# EAGLE design ATS (EAGLE 9.6.1)
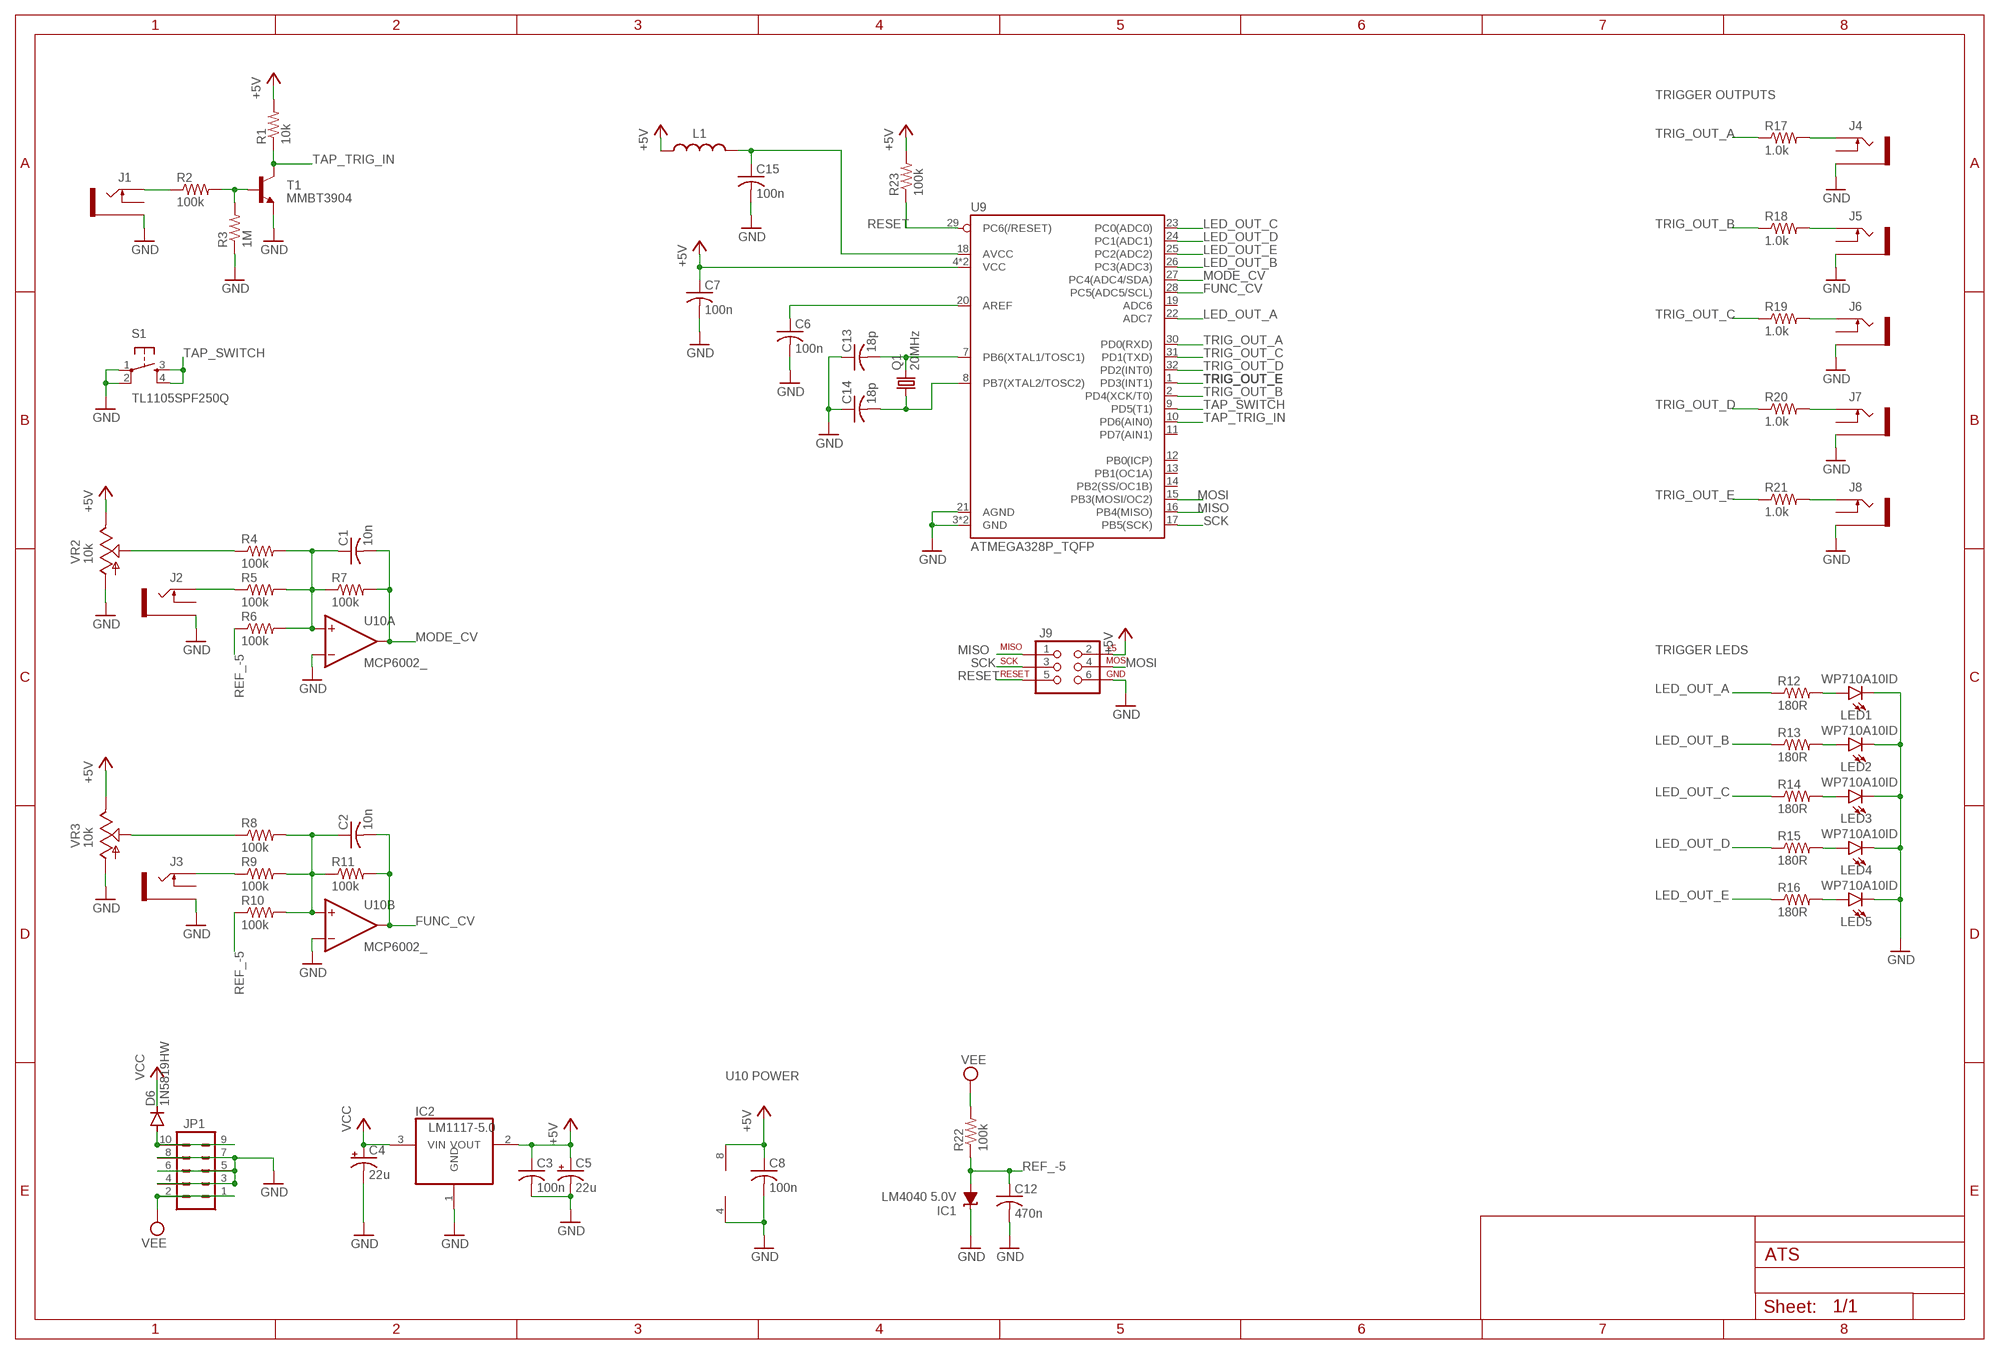
[diagram p0: schematic, sheet 1]

## Parts
C1  10n  C-USC0603  [C0603]
C2  10n  C-USC0603  [C0603]
C3  100n  C-USC0603  [C0603]
C4  22u  CPOL-USC  [PANASONIC_C]
C5  22u  CPOL-USC  [PANASONIC_C]
C6  100n  C-USC0603  [C0603]
C7  100n  C-USC0603  [C0603]
C8  100n  C-USC0603  [C0603]
C12  470n  C-USC0603  [C0603]
C13  18p  C-USC0603  [C0603]
C14  18p  C-USC0603  [C0603]
C15  100n  C-USC0603  [C0603]
D6  1N5819HW  DIODE-SOD123  [SOD123]
IC1  LM4040 5.0V  LM4041C12DBZ  [DBZ_R-PDSO-G3]
IC2  LM1117-5.0  REG1117  [SOT223]
J1  THONKICONNNEW  [WQP-PJ301M-12_JACK]
J2  THONKICONNNEW  [WQP-PJ301M-12_JACK]
J3  THONKICONNNEW  [WQP-PJ301M-12_JACK]
J4  THONKICONNNEW  [WQP-PJ301M-12_JACK]
J5  THONKICONNNEW  [WQP-PJ301M-12_JACK]
J6  THONKICONNNEW  [WQP-PJ301M-12_JACK]
J7  THONKICONNNEW  [WQP-PJ301M-12_JACK]
J8  THONKICONNNEW  [WQP-PJ301M-12_JACK]
J9  AVR_SPI_PRG_6PTH  [2X3]
JP1  EURO_POWER_HEADERREGULAR  [EURO_POWER_HEADER]
L1  470Ohm@100MHz  WE-CBF_0603_742792642_WB_HS  [WE-CBF_0603(W=2.2)]
LED1  WP710A10ID  LED3MM  [LED_3MM]
LED2  WP710A10ID  LED3MM  [LED_3MM]
LED3  WP710A10ID  LED3MM  [LED_3MM]
LED4  WP710A10ID  LED3MM  [LED_3MM]
LED5  WP710A10ID  LED3MM  [LED_3MM]
Q1  20MHz  CRYSTALHC49UP  [HC49UP]
R1  10k  R-US_R0603  [R0603]
R2  100k  R-US_R0603  [R0603]
R3  1M  R-US_R0603  [R0603]
R4  100k  R-US_R0603  [R0603]
R5  100k  R-US_R0603  [R0603]
R6  100k  R-US_R0603  [R0603]
R7  100k  R-US_R0603  [R0603]
R8  100k  R-US_R0603  [R0603]
R9  100k  R-US_R0603  [R0603]
R10  100k  R-US_R0603  [R0603]
R11  100k  R-US_R0603  [R0603]
R12  180R  R-US_R0603  [R0603]
R13  180R  R-US_R0603  [R0603]
R14  180R  R-US_R0603  [R0603]
R15  180R  R-US_R0603  [R0603]
R16  180R  R-US_R0603  [R0603]
R17  1.0k  R-US_R0603  [R0603]
R18  1.0k  R-US_R0603  [R0603]
R19  1.0k  R-US_R0603  [R0603]
R20  1.0k  R-US_R0603  [R0603]
R21  1.0k  R-US_R0603  [R0603]
R22  100k  R-US_R0603  [R0603]
R23  100k  R-US_R0603  [R0603]
S1  TL1105SPF250Q  TAC_SWITCHPTH  [TACTILE-PTH]
T1  MMBT3904  MMBT3904LT1-NPN-SOT23-BEC  [SOT23-BEC]
U9  ATMEGA328P_TQFP  [TQFP32-08]
U10  MCP6002_  [SO08]
VR2  10k  9MM_SNAP-IN_POT_  [9MM_SNAP-IN_POT]
VR3  10k  9MM_SNAP-IN_POT_  [9MM_SNAP-IN_POT]

## Nets
+5V: C3.1 C5.+ C7.1 C8.1 IC2.2(VOUT) J9.2 L1.1 R1.2 R23.2 U9.4(VCC) U9.6(VCC) U10.8(P:V+) VR2.3(E) VR3.3(E)
AREF: C6.1 U9.20(AREF)
FUNC_CV: C2.2 R11.2 U9.28(PC5(ADC5/SCL)) U10.7(B:OUT)
FUNC_JACK: J3.P$1_TIP(TIP) R9.1
FUNC_POT: R8.1 VR3.2(S)
GND: C3.2 C4.- C5.- C6.2 C7.2 C8.2 C12.2 C13.1 C14.1 C15.2 IC1.1(C) IC2.1(GND) J1.P$3_SLEEVE(SLEEVE) J2.P$3_SLEEVE(SLEEVE) J3.P$3_SLEEVE(SLEEVE) J4.P$3_SLEEVE(SLEEVE) J5.P$3_SLEEVE(SLEEVE) J6.P$3_SLEEVE(SLEEVE) J7.P$3_SLEEVE(SLEEVE) J8.P$3_SLEEVE(SLEEVE) J9.6 JP1.3 JP1.4 JP1.5 JP1.6 JP1.7 JP1.8 LED1.K(C) LED2.K(C) LED3.K(C) LED4.K(C) LED5.K(C) R3.1 S1.1 S1.2 T1.E U9.3(GND) U9.5(GND) U9.21(AGND) U10.2(A:-IN) U10.4(P:V-) U10.6(B:-IN) VR2.1(A) VR3.1(A)
LED_OUT_A: R12.1 U9.22(ADC7)
LED_OUT_B: R13.1 U9.26(PC3(ADC3))
LED_OUT_C: R14.1 U9.23(PC0(ADC0))
LED_OUT_D: R15.1 U9.24(PC1(ADC1))
LED_OUT_E: R16.1 U9.25(PC2(ADC2))
MISO: J9.1 U9.16(PB4(MISO))
MODE_CV: C1.2 R7.2 U9.27(PC4(ADC4/SDA)) U10.1(A:OUT)
MODE_JACK: J2.P$1_TIP(TIP) R5.1
MODE_POT: R4.1 VR2.2(S)
MOSI: J9.4 U9.15(PB3(MOSI/OC2))
N$1: LED1.A R12.2
N$2: C1.1 R4.2 R5.2 R6.2 R7.1 U10.3(A:+IN)
N$6: C2.1 R8.2 R9.2 R10.2 R11.1 U10.5(B:+IN)
N$8: LED2.A R13.2
N$9: LED3.A R14.2
N$10: R2.2 R3.2 T1.B
N$11: J1.P$1_TIP(TIP) R2.1
N$12: LED4.A R15.2
N$13: LED5.A R16.2
N$14: J4.P$1_TIP(TIP) R17.2
N$15: J5.P$1_TIP(TIP) R18.2
N$16: J6.P$1_TIP(TIP) R19.2
N$17: J7.P$1_TIP(TIP) R20.2
N$18: J8.P$1_TIP(TIP) R21.2
N$23: C14.2 Q1.1 U9.8(PB7(XTAL2/TOSC2))
N$24: C13.2 Q1.2 U9.7(PB6(XTAL1/TOSC1))
N$25: C15.1 L1.2 U9.18(AVCC)
N$27: D6.A JP1.9 JP1.10
REF_-5: C12.1 IC1.2(A) R6.1 R10.1 R22.1
RESET: J9.5 R23.1 U9.29(PC6(/RESET))
SCK: J9.3 U9.17(PB5(SCK))
TAP_SWITCH: S1.3 S1.4 U9.9(PD5(T1))
TAP_TRIG_IN: R1.1 T1.C U9.10(PD6(AIN0))
TRIG_OUT_A: R17.1 U9.30(PD0(RXD))
TRIG_OUT_B: R18.1 U9.2(PD4(XCK/T0))
TRIG_OUT_C: R19.1 U9.31(PD1(TXD))
TRIG_OUT_D: R20.1 U9.32(PD2(INT0))
TRIG_OUT_E: R21.1 U9.1(PD3(INT1))
VCC: C4.+ D6.C IC2.3(VIN)
VEE: JP1.1 JP1.2 R22.2
Unconnected: J1.P$2_SWITCH(SWITCH) J2.P$2_SWITCH(SWITCH) J3.P$2_SWITCH(SWITCH) J4.P$2_SWITCH(SWITCH) J5.P$2_SWITCH(SWITCH) J6.P$2_SWITCH(SWITCH) J7.P$2_SWITCH(SWITCH) J8.P$2_SWITCH(SWITCH) U9.11(PD7(AIN1)) U9.12(PB0(ICP)) U9.13(PB1(OC1A)) U9.14(PB2(SS/OC1B)) U9.19(ADC6)

## Notes on the sheet
- TRIGGER OUTPUTS
- TRIGGER LEDS
- U10 POWER

## Library data of the parts
C1-C3 C6-C8 C12-C15 = rcl:C-US: CAPACITOR, American symbol; SPICEPREFIX: C
C4 C5 = rcl:CPOL-US: POLARIZED CAPACITOR, American symbol; SPICEPREFIX: C
D6 = diode:DIODE-: DIODE
IC1 = texas:LM4041: PRECISION MICROPOWER SHUNT VOLTAGE REFERENCE Source: http://focus.ti.com/lit/ds/slcs146e/slcs146e.pdf; MF: TEXAS INSTRUMENT CONNECTORS; MPN: LM4041C12QDBZT; OC_FARNELL: 1771733; OC_NEWARK: 43K3376
IC2 = burr-brown:REG1117: 800mA and 1A Low Dropout (LDO) Positive Regulator 1.8V, 2.5V, 2.85V, 3.3V, 5V, and Adj; MPN: REG1117; OC_FARNELL: 1097566; OC_NEWARK: 14P6981
J1-J8 = MusicThingModular:THONKICONN: 3.5mm socket for Eurorack modular synths
J9 = SparkFun:AVR_SPI_PRG_6: AVR ISP 6 Pin This is the reduced ISP connector for AVR programming. Common on Arduino. This footprint will take up less PCB space and can be used with a 10-pin to 6-pin adapter such as SKU: BOB-08508
JP1 = MusicThingModular:EURO_POWER_HEADER: Power Header 10 pin power header for Eurorack Power Supplies Variants with fatter pads for easier soldering, and the LOCK variant which has 5mil offset pins to hold the component in place before soldering
L1 = Eagle_WE-CBF_rev19b:WE-CBF_0603: WE-CBF SMD EMI Suppression Ferrite Bead Characteristics Reliable Ni-Sn electrodes High rated current up to 6 A Operating temperature: –55 ºC to +125 ºC Applications Perfect as data lined filter and for uncoupling of distribution voltage Package name and Variant abbreviation: Package: Wide Band /High Speed: W=Width= 2.2 High Current: W=Width= 2.6 Variant abbreviation: WB = Wide Band HS=High Speed HC=High Current <https://katalog.we-online.de/media/images/v2/o14753v209%20Family_WE-CBF.jpg> Details see: http://katalog.we-online.de/en/pbs/WE-CBF Updated by Ella Wu 2019-01-02 2019 (C) Wurth Elektronik; DATASHEET-URL: https://www.we-online.com/catalog/datasheet/742792642.pdf; IR1: 200mA; IR2: 950mA; MOUNT: SMT; PART-NUMBER: 742792642; RDC-MAX: 0.45Ohm; TYPE: Wide Band; Z: 256Ohm@1GMHz; ZMAX: 780Ohm
LED1 = SparkFun-LED:LED: LED (Generic) Standard schematic elements and footprints for 5mm, 3mm, 1206, and 0603 sized LEDs. Generic LEDs with no color specified.; PROD_ID: DIO-08794; SPICEPREFIX: D
LED2-LED5 = SparkFun-LED:LED: LED (Generic) Standard schematic elements and footprints for 5mm, 3mm, 1206, and 0603 sized LEDs. Generic LEDs with no color specified.; PROD_ID: DIO-08794
Q1 = crystal:CRYSTAL: CRYSTAL; OC_FARNELL: unknown; OC_NEWARK: unknown
R1-R23 = rcl:R-US_: RESISTOR, American symbol; SPICEPREFIX: R
S1 = SparkFun-Retired:TAC_SWITCH: Momentary Switch Button commonly used for reset or general input. Spark Fun Electronics SKU : COM-00097 SMT- SWCH-08247
T1 = MusicThingModular:*-NPN-: NPN Transistror BF959 corrected 2008.03.06
U9 = SparkFun-IC-Microcontroller:ATMEGA328P_TQFP: Popular 328P in QFP Storefront component: ATmega328 - TQFP <https://www.sparkfun.com/products/13448> (COM-13448) Datasheet <http://www.sparkfun.com/datasheets/Components/SMD/ATMega328.pdf> SparkFun Products SparkFun RedBoard - Programmed with Arduino <https://www.sparkfun.com/products/12757> (DEV-12757) Arduino Pro Mini 328 - 5V/16MHz <https://www.sparkfun.com/products/11113> (DEV-11113) Arduino Pro Mini 328 - 3.3V/8MHz <https://www.sparkfun.com/products/11114> (DEV-11114) SparkFun OpenLog <https://www.sparkfun.com/products/13712> (DEV-13712) SparkFun MicroView - OLED Arduino Module <https://www.sparkfun.com/products/12923> (DEV-12923) SparkFun Digital Sandbox <https://www.sparkfun.com/products/12651> (DEV-12651) SparkFun PicoBoard <https://www.sparkfun.com/products/11888> (WIG-11888) Arduino Fio <https://www.sparkfun.com/products/10116> (DEV-10116) LilyPad Arduino 328 Main Board <https://www.sparkfun.com/products/13342> (DEV-13342) SparkFun RedStick <https://www.sparkfun.com/products/13741> (DEV-13741) LilyPad MP3 <https://www.sparkfun.com/products/11013> (DEV-11013) LilyPad Arduino SimpleSnap <https://www.sparkfun.com/products/10941> (DEV-10941) SparkFun Stepoko <https://www.sparkfun.com/products/13899> (ROB-13899) SparkFun Geiger Counter <https://www.sparkfun.com/products/11345> (SEN-11345) SparkFun EL Sequencer <https://www.sparkfun.com/products/12781> (COM-12781) Arduino Pro 328 - 5V/16MHz <https://www.sparkfun.com/products/10915> (DEV-10915) CryptoCape <https://www.sparkfun.com/products/12773> (DEV-12773) SparkFun IR Thermometer Evaluation Board - MLX90614 <https://www.sparkfun.com/products/10740> (SEN-10740) SparkFun RedBot Mainboard <https://www.sparkfun.com/products/12097> (ROB-12097) Arduino Pro 328 - 3.3V/8MHz <https://www.sparkfun.com/products/10914> (DEV-10914) SparkFun Block for Intel® Edison - Arduino <https://www.sparkfun.com/products/13036> (DEV-13036) SparkFun Simon Says - Surface Mount Soldering Kit <https://www.sparkfun.com/products/10935> (KIT-10935) SparkFun 7-Segment Serial Display - Red <https://www.sparkfun.com/products/11441> (COM-11441) SparkFun 7-Segment Serial Display - White <https://www.sparkfun.com/products/11629> (COM-11629) SparkFun 7-Segment Serial Display - Yellow <https://www.sparkfun.com/products/11443> (COM-11443) SparkFun 7-Segment Serial Display - Kelly Green <https://www.sparkfun.com/products/11440> (COM-11440) SparkFun 7-Segment Serial Display - Blue <https://www.sparkfun.com/products/11442> (COM-11442) SparkFun OpenSegment Serial Display - 20mm (Blue) <https://www.sparkfun.com/products/11647> (COM-11647) SparkFun OpenSegment Serial Display - 20mm (Green) <https://www.sparkfun.com/products/11646> (COM-11646) SparkFun OpenSegment Serial Display - 20mm (White) <https://www.sparkfun.com/products/11648> (COM-11648) SparkFun OpenSegment Serial Display - 20mm (Red) <https://www.sparkfun.com/products/11644> (COM-11644) SparkFun OpenSegment Serial Display - 20mm (Yellow) <https://www.sparkfun.com/products/11645> (COM-11645) SparkFun OpenSegment Shield <https://www.sparkfun.com/products/13190> (DEV-13190); PROD_ID: IC-09069
U10 = MusicThingModular:MCP6002: Generic Dual Op Amp
VR2 VR3 = MusicThingModular:9MM_SNAP-IN_POT: 9mm vertical snap-in pot, Alpha / Panasonic style

## Board
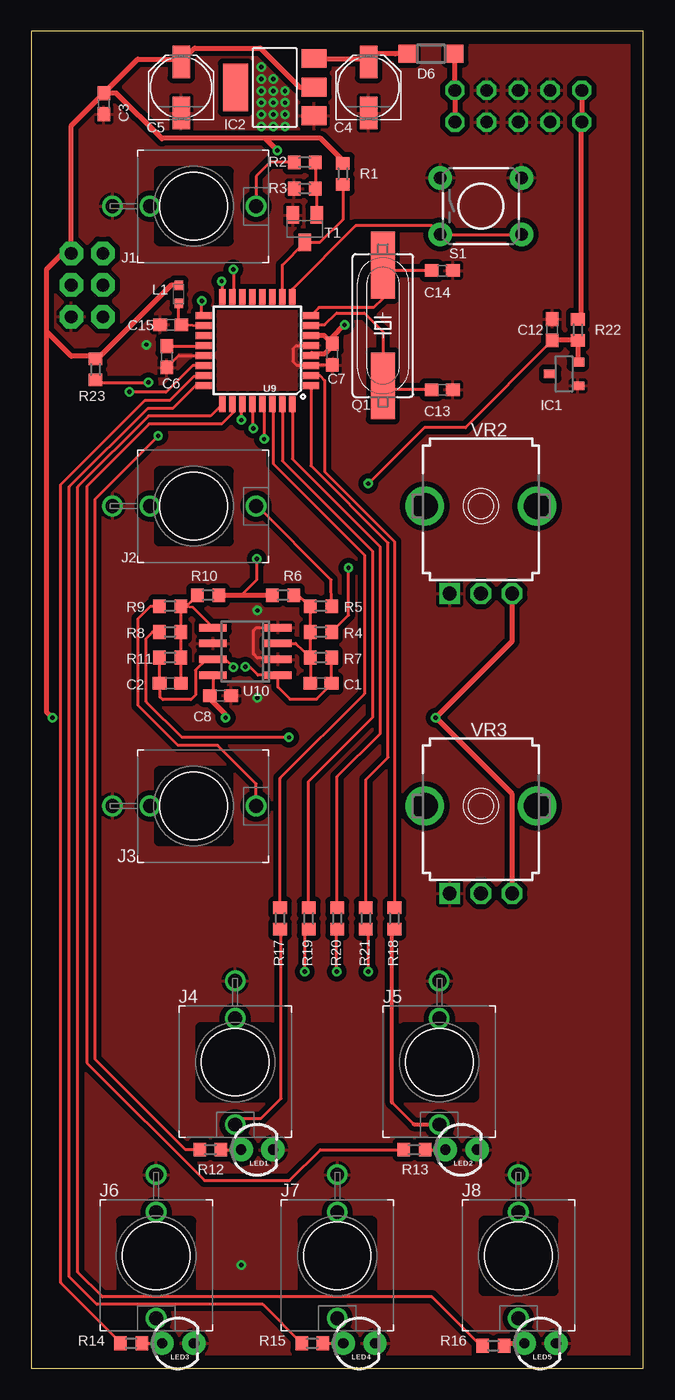
[diagram p1: board, top side]
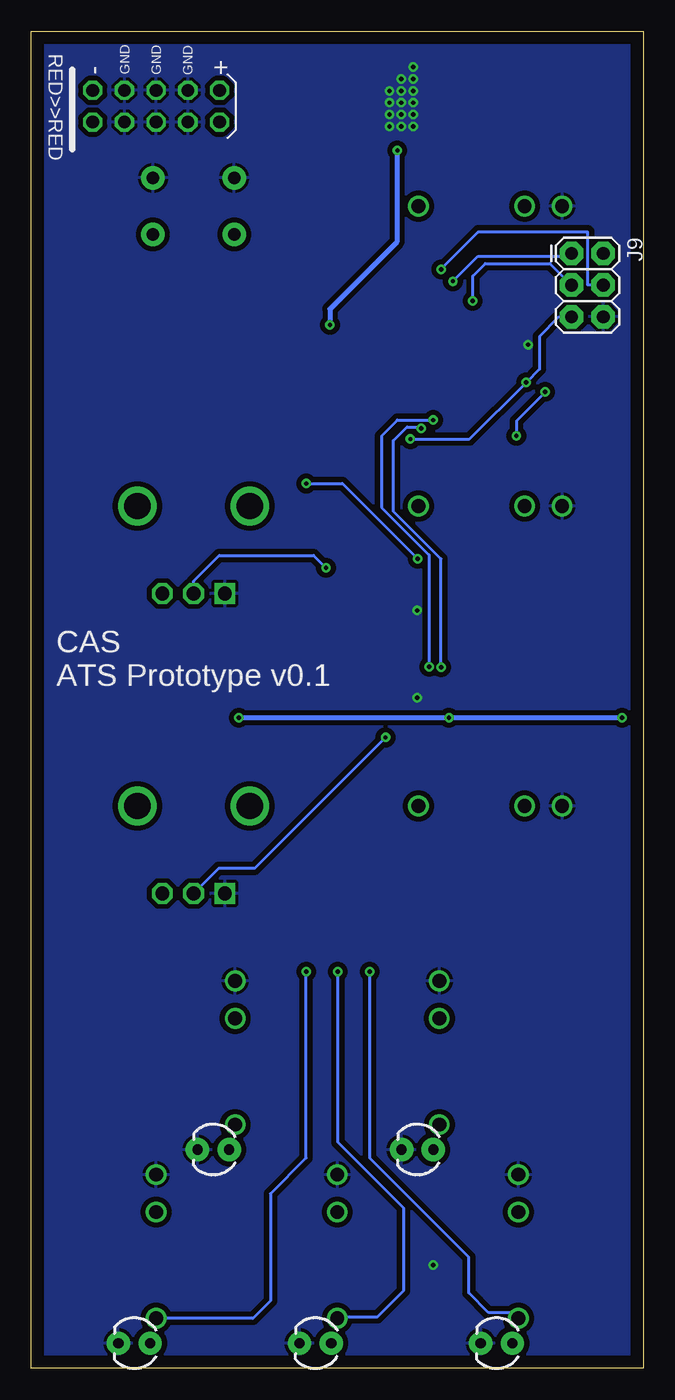
[diagram p2: board, bottom side, seen from below]

Size 49 x 107 mm. Coordinates in mm from the lower left corner, seen from the top.
Outline: 0,0 49,0 49,107 0,107 0,0
Copper layers (1*16): Top 0.035mm / dielectric 1.5mm / Bottom 0.035mm
Design rules "default": minimum track width 6mil, minimum drill 0.35mm, track to track 6mil, track to pad 6mil, pad to pad 6mil, via to via 6mil, smd to smd 6mil, copper to edge 40mil, drill to drill 6mil, minimum pad ring 10mil, minimum via ring 8mil, stop-mask expansion 4mil, vias tented up to drill 0mil, thermal gap 10mil

### Footprints (pad centres in the part's own frame; a part is rotated, then mirrored left to right if it is on the bottom)
C0603 = smd 1.1 x 1: 1 -0.85,0; 2 0.85,0
PANASONIC_C = smd 2.6 x 1.4: + 2.05,0; - -2.05,0
SOD123 = smd 1.4 x 1.4: A 1.9,0; C -1.9,0
DBZ_R-PDSO-G3 = smd 0.7 x 1: 1 -0.95,-1.1; 2 0.95,-1.1; 3 0,1.1
SOT223 = smd 1.499 x 2.007: 1 -2.261,-3.15; 2 0.025,-3.15; 3 2.311,-3.15 | smd 3.81 x 2.007: 4 0,3.15
WQP-PJ301M-12_JACK = drill 1.1: P$1_TIP 0,5; P$2_SWITCH 0,-3.5; P$3_SLEEVE 0,-6.5
2X3 = drill 1.016 pad 1.88 octagon: 1 0,0; 2 0,2.54; 3 2.54,0; 4 2.54,2.54; 5 5.08,0; 6 5.08,2.54
EURO_POWER_HEADER = drill 1.016 octagon: 1 -5.08,-1.27; 2 -5.08,1.27; 3 -2.54,-1.27; 4 -2.54,1.27; 5 0,-1.27; 6 0,1.27; 7 2.54,-1.27; 8 2.54,1.27; 9 5.08,-1.27; 10 5.08,1.27
WE-CBF_0603(W=2.2) = smd 0.75 x 0.7: 1 -0.725,0; 2 0.725,0
LED_3MM = drill 0.813 pad 1.88: A -1.27,0; K 1.27,0
HC49UP = smd 5.334 x 1.93: 1 -4.826,0; 2 4.826,0
R0603 = smd 1 x 1.1: 1 -0.85,0; 2 0.85,0
TACTILE-PTH = drill 1.016 pad 1.88: 1 -3.251,2.261; 2 3.251,2.261; 3 -3.251,-2.261; 4 3.251,-2.261
SOT23-BEC = smd 1 x 1.4: B -0.95,-1.1; C 0,1.1; E 0.95,-1.1
TQFP32-08 = smd 1.27 x 0.559: 1 -4.293,2.8; 2 -4.293,2; 3 -4.293,1.2; 4 -4.293,0.4; 5 -4.293,-0.4; 6 -4.293,-1.2; 7 -4.293,-2; 8 -4.293,-2.8; 17 4.293,-2.8; 18 4.293,-2; 19 4.293,-1.2; 20 4.293,-0.4; 21 4.293,0.4; 22 4.293,1.2; 23 4.293,2; 24 4.293,2.8 | smd 0.559 x 1.27: 9 -2.8,-4.293; 10 -2,-4.293; 11 -1.2,-4.293; 12 -0.4,-4.293; 13 0.4,-4.293; 14 1.2,-4.293; 15 2,-4.293; 16 2.8,-4.293; 25 2.8,4.293; 26 2,4.293; 27 1.2,4.293; 28 0.4,4.293; 29 -0.4,4.293; 30 -1.2,4.293; 31 -2,4.293; 32 -2.8,4.293
SO08 = smd 0.6 x 2.2: 1 -1.905,-2.6; 2 -0.635,-2.6; 3 0.635,-2.6; 4 1.905,-2.6; 5 1.905,2.6; 6 0.635,2.6; 7 -0.635,2.6; 8 -1.905,2.6
9MM_SNAP-IN_POT = drill 1.1 square: 1 -2.5,-7 | drill 1.1 octagon: 2 0,-7; 3 2.5,-7 | drill 2.1 pad 2.794: CHASSIS1 -4.5,0; CHASSIS2 4.5,0

### Placement (x,y rotation side)
C1  23.19,54.81 0 top
C2  11.13,54.81 180 top
C3  5.8,101.2 270 top
C4  27,102.5 90 top
C5  12,102.5 90 top
C6  10.86,80.95 270 top
C7  24.1,81.15 270 top
C8  15.16,53.82 0 top
C12  41.71,83.11 90 top
C13  32.91,78.31 180 top
C14  32.92,87.84 180 top
C15  11.18,83.52 180 top
D6  32,105.2 0 top
IC1  42.66,79.58 90 top
IC2  19.5,102.5 90 top
J1  13,93 270 top
J2  13,69 270 top
J3  13,45 270 top
J4  16.33,24.5 180 top
J5  32.67,24.5 180 top
J6  10,9 180 top
J7  24.5,9 180 top
J8  39,9 180 top
J9  5.74,89.22 270 bottom
JP1  39,101 0 bottom
L1  11.82,85.95 270 top
LED1  18.08,17.5 0 top
LED2  34.42,17.5 0 top
LED3  11.75,2 0 top
LED4  26.25,2 0 top
LED5  40.75,2 0 top
Q1  28.15,83.45 270 top
R1  24.95,95.58 90 top
R2  21.89,96.51 0 top
R3  21.89,94.4 0 top
R4  23.19,58.93 180 top
R5  23.19,60.99 180 top
R6  20.16,61.87 0 top
R7  23.19,56.87 0 top
R8  11.13,58.93 0 top
R9  11.13,60.99 0 top
R10  14.16,61.87 180 top
R11  11.13,56.87 180 top
R12  14.33,17.5 0 top
R13  30.67,17.5 0 top
R14  8,2 0 top
R15  22.5,2 0 top
R16  37,1.8 0 top
R17  19.93,36 270 top
R18  29.07,36 270 top
R19  22.21,36 270 top
R20  24.5,36 270 top
R21  26.78,36 270 top
R22  43.76,83.11 90 top
R23  5.14,79.95 90 top
S1  36,93 0 top
T1  21.89,91.19 180 top
U9  18.1,81.45 180 top
U10  17.16,57.37 90 top
VR2  36,69 0 top
VR3  36,45 0 top

### Tracks (layer width: path | path; a pad name or v marks a point on that pad's centre or on a via)
+5V  (via drill 0.35)
  Top 0.254: U10.8 14.56,54.12 C8.1
  Top 0.406: U9.4 22.46,81.21 23.52,81.21 24.1,81.8 C7.1 | C7.1 23.45,82.65 U9.6 | IC2.2 21.48,102.53 18.35,105.65 13.1,105.65 12.22,104.78 | C8.1 14.31,53.55 15.56,52.3 v15.56,52.07 | R1.2 24.95,96.66 23.18,98.42 18.73,98.42 | 18.73,98.42 10.46,98.42 10.46,98.39 6.8,102.05 C3.1 | 1.22,83 1.22,87.92 2.52,89.22 J9.2 3.2,99.45 C3.1 | 1.22,83 1.22,52.56 v1.71,52.07 | VR2.3 38.5,58.19 v32.38,52.07 38.5,45.95 VR3.3 | C5.+ 12.22,104.78 | v19.68,97.47 18.73,98.42 | 1.22,83 3.22,81 4.94,81 R23.2 5.31,80.8 11.18,86.67 L1.1 | C3.1 8.53,104.78 12.22,104.78 | C7.1 24.1,82.52 v25.08,83.5
  Bottom 0.406: v32.38,52.07 v15.56,52.07 v1.71,52.07 | v25.08,83.5 25.08,84.77 19.68,90.17 v19.68,97.47
AREF
  Top 0.254: C6.1 13.66,81.8 U9.20
FUNC_CV  (via drill 0.35)
  Top 0.254: R11.2 C2.2 10.31,53.72 10.52,53.51 12.79,53.51 13.16,53.87 13.16,55.87 14.02,56.73 U10.7 15.56,56.73 15.56,56.74 v16.19,56.1 | U9.28 17.7,75.31 v17.78,75.22
  Bottom 0.254: v16.19,56.1 16.19,64.77 20,68.58 20,74.25 18.91,75.34 17.89,75.34 v17.78,75.22
FUNC_JACK
  Top 0.254: J3.P$1_TIP 18,46.77 14.92,49.85 11.75,49.85 8.57,53.02 8.57,60.01 9.55,60.98 R9.1
FUNC_POT  (via drill 0.35)
  Top 0.254: v20.64,50.48 12.06,50.48 9.21,53.34 9.21,58.42 9.72,58.93 R8.1
  Bottom 0.254: v20.64,50.48 31.11,40.01 33.99,40.01 VR3.2
GND  (via drill 0.35)
  Top 0.254: C6.2 11.81,81.05 U9.21 | C7.2 22.44,80.3 U9.3 21.27,80.25 20.95,80.56 20.95,81.6 21.2,81.85 U9.5 | U10.2 19.66,56.83 18.1,56.83 17.78,57.15 17.78,59.05 18,59.27 U10.4
  other vias: 9.21,81.92 18.1,53.66 16.83,8.26 18.1,60.64 18.41,104.14 18.41,103.19 19.37,103.19 18.41,102.23 19.37,101.28 20.32,101.28 18.41,101.28 18.41,100.33 19.37,100.33 20.32,100.33 18.41,99.38 19.37,99.38 20.32,99.38 19.37,102.23 20.32,102.23
  pour Top (isolate 0.406): 0,107 49,107 49,0 0,0
  pour Bottom (isolate 0.406): 0,107 49,107 49,0 0,0
LED_OUT_A  (via drill 0.35)
  Top 0.254: R12.1 12.35,17.5 5.08,24.77 5.08,69.53 v10.16,74.61 | U9.22 12.94,80.25 10.79,78.11 7.88,78.11 v7.85,78.13
  Bottom 0.254: v7.85,78.13 10.16,75.82 v10.16,74.61
LED_OUT_B
  Top 0.254: R13.1 23.15,17.5 20.68,15.03 13.86,15.03 4.45,24.45 4.45,70.58 9.43,75.56 15.24,75.56 16.19,76.52 16.19,77.06 U9.26
LED_OUT_C
  Top 0.254: R14.1 7.15,2.06 2.37,6.84 2.37,70.73 9.1,77.47 11.11,77.47 13.02,79.38 13.73,79.38 U9.23
LED_OUT_D
  Top 0.254: R15.1 18.55,5.1 5.25,5.1 3.05,7.3 3.05,70.54 9.34,76.83 11.36,76.83 13.17,78.65 U9.24
LED_OUT_E
  Top 0.254: R16.1 35.98,1.8 32.07,5.71 5.71,5.71 3.73,7.7 3.73,70.54 9.39,76.2 14.35,76.2 U9.25
MISO  (via drill 0.35)
  Top 0.254: U9.16 15.3,86.94 v15.24,87
  Bottom 0.254: J9.1 5.97,89 13.24,89 v15.24,87
MODE_CV  (via drill 0.35)
  Top 0.254: v17.14,56.15 17.46,56.15 18.15,55.47 U10.1 19.76,54.51 20.72,53.55 22.84,53.55 24.01,54.72 C1.2 R7.2 | U9.27 16.83,77.16 v16.83,75.88
  Bottom 0.254: v16.83,75.88 19.68,75.88 20.95,74.61 20.95,68.9 17.14,65.09 v17.14,56.15
MODE_JACK
  Top 0.254: R5.1 24.01,63.09 18.1,69 J2.P$1_TIP
MODE_POT  (via drill 0.35)
  Top 0.254: R4.1 25.4,60.26 v25.4,64.06
  Bottom 0.254: VR2.2 36,63 33.95,65.06 26.4,65.06 v25.4,64.06
MOSI  (via drill 0.35)
  Top 0.254: v16.19,87.95 16.19,85.83 U9.15
  Bottom 0.254: J9.4 4.45,86.68 4.45,90.95 13.19,90.95 v16.19,87.95
N$1
  Top 0.254: R12.2 LED1.A
N$2
  Top 0.254: U10.3 21.17,58.01 R7.1 | R7.1 C1.1 | R7.1 R4.2 R5.2 21.31,61.87 R6.2
N$6
  Top 0.254: R9.2 R8.2 R11.1 C2.1 | U10.5 12.96,60.87 R9.2 | R9.2 12.31,60.87 R10.2
N$8
  Top 0.254: R13.2 LED2.A
N$9
  Top 0.254: R14.2 LED3.A
N$10
  Top 0.254: R2.2 R3.2 22.84,94.3 T1.B
N$11
  Top 0.254: R2.1 19.12,96.51 18,95.39 J1.P$1_TIP
N$12
  Top 0.254: R15.2 LED4.A
N$13
  Top 0.406: R16.2 38.05,2 LED5.A
N$14
  Top 0.254: J4.P$1_TIP 16.83,20 18.41,20 20,21.59 20,34.57 R17.2
N$15
  Top 0.254: 30.64,19.53 28.89,21.27
  Top 0.305: 28.89,21.27 28.89,34.97 R18.2 | 30.64,19.53 32.64,19.53 J5.P$1_TIP
N$16  (via drill 0.35)
  Top 0.254: v21.91,31.75 21.91,35.1 R19.2
  Bottom 0.254: v21.91,31.75 21.91,16.83 13.97,8.89 13.97,6.03 12.38,4.45 10.45,4.45 J6.P$1_TIP
N$17  (via drill 0.35)
  Top 0.254: v24.45,31.75 24.45,35.1 R20.2
  Bottom 0.254: v24.45,31.75 24.45,18.1 19.21,12.86 19.21,6.19 21.27,4.13 24.37,4.13 J7.P$1_TIP
N$18  (via drill 0.35)
  Top 0.254: v26.99,31.75 26.99,35.1 R21.2
  Bottom 0.254: v26.99,31.75 26.99,16.83 29.84,13.97 29.84,5.4 31.24,4 J8.P$1_TIP
N$23
  Top 0.254: Q1.1 | Q1.1 28.15,85.62 27.41,84.88 23.03,84.88 U9.8 | C14.2 28.57,87.84 Q1.1
N$24
  Top 0.254: U9.7 22.45,83.5 23.5,83.5 24.45,84.45 26.67,84.45 28.15,82.97 Q1.2 28.46,78.31 C13.2
N$25
  Top 0.254: U9.18 C15.1 11.82,83.7 L1.2
N$27
  Top 0.406: D6.A 33.92,105.18 JP1.10 JP1.9
REF_-5  (via drill 0.35)
  Top 0.254: 16.83,61.87 18.05,63.09 v18.05,64.77 | C12.1 34.77,75.28 31.46,75.28 v26.99,70.8
  Top 0.406: IC1.2 R22.1 C12.1 | R10.1 16.83,61.87 R6.1
  Bottom 0.254: v26.99,70.8 24.08,70.8 v18.05,64.77
RESET  (via drill 0.35)
  Top 0.254: v18.64,74.36 18.64,76.98 18.5,77.12 U9.29 | v9.37,78.9 5.24,78.9 5.14,78.99 R23.1
  Bottom 0.254: v18.64,74.36 13.9,74.36 v9.37,78.9 8.32,79.95 8.32,82.57 6.74,84.14 J9.5
SCK  (via drill 0.35)
  Top 0.254: U9.17 13.65,84.4 v13.65,85.41
  Bottom 0.254: v13.65,85.41 13.65,87.41 12.65,88.41 7.47,88.41 J9.3
TAP_SWITCH
  Top 0.254: S1.4 S1.3 32.75,90.76 32.07,91.44 25.96,91.44 20.9,86.38 U9.9
TAP_TRIG_IN
  Top 0.254: U9.10 20.1,88.29 T1.C 23.09,90.08 24.95,91.94 R1.1
TRIG_OUT_A
  Top 0.254: U9.30 19.37,77.09 19.37,72.39 26.67,65.09 26.67,53.98 19.93,47.23 R17.1
TRIG_OUT_B
  Top 0.254: U9.2 23.11,79.45 23.5,79.06 23.5,71.75 29.07,66.18 R18.1
TRIG_OUT_C
  Top 0.254: U9.31 20.1,72.61 27.3,65.41 27.3,52.07 22.21,46.98 R19.1
TRIG_OUT_D
  Top 0.254: U9.32 20.9,72.76 27.94,65.72 27.94,50.8 24.5,47.36 R20.1
TRIG_OUT_E
  Top 0.254: U9.1 22.39,72.22 28.57,66.04 28.57,48.9 26.78,47.1 R21.1
VCC
  Top 0.406: D6.C 29.15,105.2 29.13,105.19 27.64,105.19 27.11,104.66 | 27.11,104.66 C4.+ | 27.11,104.66 26.95,104.81 IC2.3
VEE
  Top 0.406: R22.2 44,84.2 44,99 | 44,99 44,99.65 JP1.1 | JP1.2 44.08,99.08 44,99

### Text on the board
bNames: CAS / ATS Prototype v0.1